# EasyEDA Pro project EZEDA_OpenLightingController.epro

# Schematic Main Schematic
Board Name: Board1; Create Date: 2026-04-04; Page Name: P1; Project Name: OpenLightingController; Schematic Name: Main Schematic; Update Date: 2026-04-09; Company: EasyEDA.com; Page Size: A4; Version: V1.0
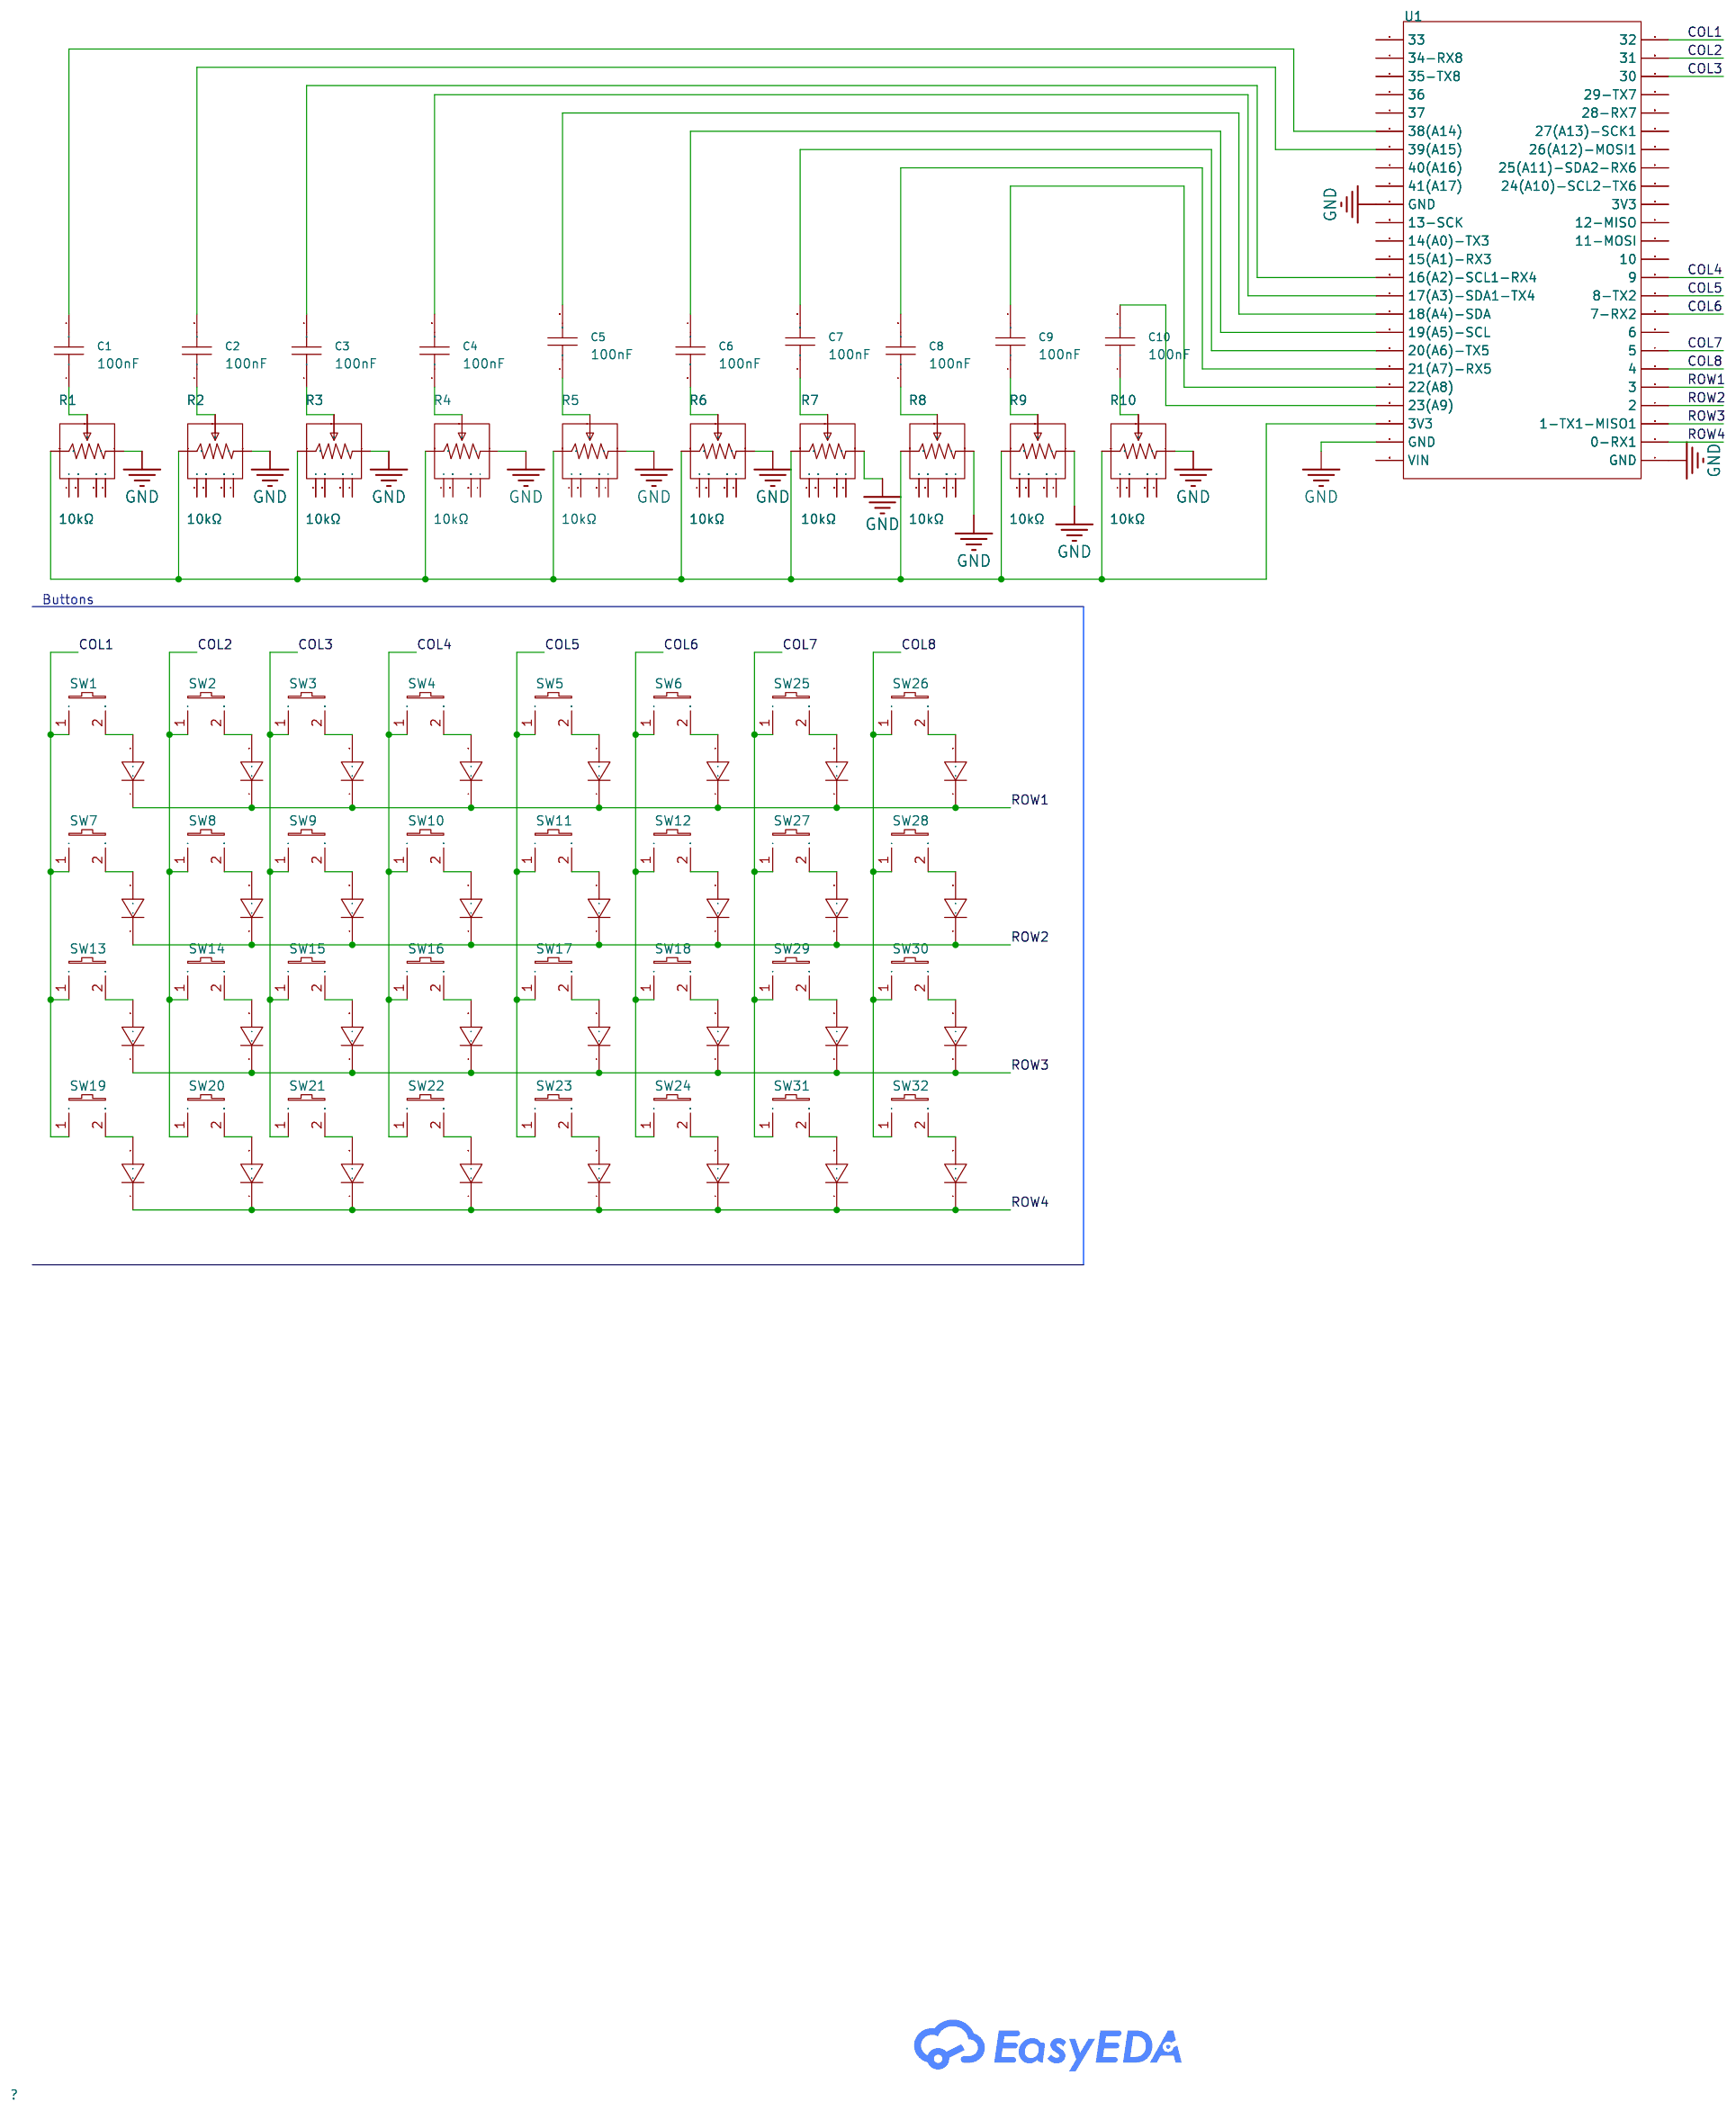
[diagram p0: schematic sheet]

## Parts
C1  100nF  [CAP-TH_L5.8-W2.4-P2.54-D0.6]
C2  100nF  [CAP-TH_L5.8-W2.4-P2.54-D0.6]
C3  100nF  [CAP-TH_L5.8-W2.4-P2.54-D0.6]
C4  100nF  [CAP-TH_L5.8-W2.4-P2.54-D0.6]
C5  100nF  [CAP-TH_L5.8-W2.4-P2.54-D0.6]
C6  100nF  [CAP-TH_L5.8-W2.4-P2.54-D0.6]
C7  100nF  [CAP-TH_L5.8-W2.4-P2.54-D0.6]
C8  100nF  [CAP-TH_L5.8-W2.4-P2.54-D0.6]
C9  100nF  [CAP-TH_L5.8-W2.4-P2.54-D0.6]
C10  100nF  [CAP-TH_L5.8-W2.4-P2.54-D0.6]
D1  1N4148  [DO-35_BD2.0-L4.0-P8.00-D0.5-FD]
D2  1N4148  [DO-35_BD2.0-L4.0-P8.00-D0.5-FD]
D3  1N4148  [DO-35_BD2.0-L4.0-P8.00-D0.5-FD]
D4  1N4148  [DO-35_BD2.0-L4.0-P8.00-D0.5-FD]
D5  1N4148  [DO-35_BD2.0-L4.0-P8.00-D0.5-FD]
D6  1N4148  [DO-35_BD2.0-L4.0-P8.00-D0.5-FD]
D7  1N4148  [DO-35_BD2.0-L4.0-P8.00-D0.5-FD]
D8  1N4148  [DO-35_BD2.0-L4.0-P8.00-D0.5-FD]
D9  1N4148  [DO-35_BD2.0-L4.0-P8.00-D0.5-FD]
D10  1N4148  [DO-35_BD2.0-L4.0-P8.00-D0.5-FD]
D11  1N4148  [DO-35_BD2.0-L4.0-P8.00-D0.5-FD]
D12  1N4148  [DO-35_BD2.0-L4.0-P8.00-D0.5-FD]
D13  1N4148  [DO-35_BD2.0-L4.0-P8.00-D0.5-FD]
D14  1N4148  [DO-35_BD2.0-L4.0-P8.00-D0.5-FD]
D15  1N4148  [DO-35_BD2.0-L4.0-P8.00-D0.5-FD]
D16  1N4148  [DO-35_BD2.0-L4.0-P8.00-D0.5-FD]
D17  1N4148  [DO-35_BD2.0-L4.0-P8.00-D0.5-FD]
D18  1N4148  [DO-35_BD2.0-L4.0-P8.00-D0.5-FD]
D19  1N4148  [DO-35_BD2.0-L4.0-P8.00-D0.5-FD]
D20  1N4148  [DO-35_BD2.0-L4.0-P8.00-D0.5-FD]
D21  1N4148  [DO-35_BD2.0-L4.0-P8.00-D0.5-FD]
D22  1N4148  [DO-35_BD2.0-L4.0-P8.00-D0.5-FD]
D23  1N4148  [DO-35_BD2.0-L4.0-P8.00-D0.5-FD]
D24  1N4148  [DO-35_BD2.0-L4.0-P8.00-D0.5-FD]
D25  1N4148  [DO-35_BD2.0-L4.0-P8.00-D0.5-FD]
D26  1N4148  [DO-35_BD2.0-L4.0-P8.00-D0.5-FD]
D27  1N4148  [DO-35_BD2.0-L4.0-P8.00-D0.5-FD]
D28  1N4148  [DO-35_BD2.0-L4.0-P8.00-D0.5-FD]
D29  1N4148  [DO-35_BD2.0-L4.0-P8.00-D0.5-FD]
D30  1N4148  [DO-35_BD2.0-L4.0-P8.00-D0.5-FD]
D31  1N4148  [DO-35_BD2.0-L4.0-P8.00-D0.5-FD]
D32  1N4148  [DO-35_BD2.0-L4.0-P8.00-D0.5-FD]
R1  10kΩ  [RES-ADJ-TH_PTA6043-2015DPB103]
R2  10kΩ  [RES-ADJ-TH_PTA6043-2015DPB103]
R3  10kΩ  [RES-ADJ-TH_PTA6043-2015DPB103]
R4  10kΩ  [RES-ADJ-TH_PTA6043-2015DPB103]
R5  10kΩ  [RES-ADJ-TH_PTA6043-2015DPB103]
R6  10kΩ  [RES-ADJ-TH_PTA6043-2015DPB103]
R7  10kΩ  [RES-ADJ-TH_PTA6043-2015DPB103]
R8  10kΩ  [RES-ADJ-TH_PTA6043-2015DPB103]
R9  10kΩ  [RES-ADJ-TH_PTA6043-2015DPB103]
R10  10kΩ  [RES-ADJ-TH_PTA6043-2015DPB103]
SW1  MX Switch  [SW-TH_MX1A-11NW]
SW2  MX Switch  [SW-TH_MX1A-11NW]
SW3  MX Switch  [SW-TH_MX1A-11NW]
SW4  MX Switch  [SW-TH_MX1A-11NW]
SW5  MX Switch  [SW-TH_MX1A-11NW]
SW6  MX Switch  [SW-TH_MX1A-11NW]
SW7  MX Switch  [SW-TH_MX1A-11NW]
SW8  MX Switch  [SW-TH_MX1A-11NW]
SW9  MX Switch  [SW-TH_MX1A-11NW]
SW10  MX Switch  [SW-TH_MX1A-11NW]
SW11  MX Switch  [SW-TH_MX1A-11NW]
SW12  MX Switch  [SW-TH_MX1A-11NW]
SW13  MX Switch  [SW-TH_MX1A-11NW]
SW14  MX Switch  [SW-TH_MX1A-11NW]
SW15  MX Switch  [SW-TH_MX1A-11NW]
SW16  MX Switch  [SW-TH_MX1A-11NW]
SW17  MX Switch  [SW-TH_MX1A-11NW]
SW18  MX Switch  [SW-TH_MX1A-11NW]
SW19  MX Switch  [SW-TH_MX1A-11NW]
SW20  MX Switch  [SW-TH_MX1A-11NW]
SW21  MX Switch  [SW-TH_MX1A-11NW]
SW22  MX Switch  [SW-TH_MX1A-11NW]
SW23  MX Switch  [SW-TH_MX1A-11NW]
SW24  MX Switch  [SW-TH_MX1A-11NW]
SW25  MX Switch  [SW-TH_MX1A-11NW]
SW26  MX Switch  [SW-TH_MX1A-11NW]
SW27  MX Switch  [SW-TH_MX1A-11NW]
SW28  MX Switch  [SW-TH_MX1A-11NW]
SW29  MX Switch  [SW-TH_MX1A-11NW]
SW30  MX Switch  [SW-TH_MX1A-11NW]
SW31  MX Switch  [SW-TH_MX1A-11NW]
SW32  MX Switch  [SW-TH_MX1A-11NW]
U1  -  [teensy 4.1]

## Library data of the parts
C1-C10 = CC1H104ZA1ED3F5P1100: Capacitance:100nF Tolerance:-20%~+80% Tolerance:-20%~+80% Voltage Rating:50V Pin Spacing:2.54mm Temperature Coefficient:Y5V Diameter:5.8mm Body Thickness:2.4mm; LCSC Part Name: 100nF -20%~+80% 50V; Supplier Part: C2832506; Manufacturer: Dersonic(德尔创); Supplier Footprint: 插件,P=2.54mm; JLCPCB Part Class: Extended Part; Datasheet: https://item.szlcsc.com/datasheet/CC1H104ZA1ED3F5P1100/2990644.html; Supplier: LCSC; Tolerance: -20%~+80%; Voltage Rating: 50V; Pin Spacing: 2.54mm; Temperature Coefficient: Y5V; Diameter: 5.8mm; Body Thickness: 2.4mm
D1-D32 = 1N4148_C258182: Diode Configuration:- Voltage - Forward(Vf@If):1V@10mA Voltage - DC Reverse(Vr):100V Current - Rectified:200mA Pd - Power Dissipation:500mW Reverse Leakage Current (Ir):5uA@75V Reverse Recovery Time (trr):4ns Operating Junction Temperature Range:-55℃~+175; LCSC Part Name: 100V 200mA; Supplier Part: C258182; Manufacturer: onsemi(安森美); Supplier Footprint: DO-35; JLCPCB Part Class: Extended Part; Datasheet: https://item.szlcsc.com/datasheet/1N4148/251208.html; Supplier: LCSC; Voltage - Forward(Vf@If): 1V@10mA; Voltage - DC Reverse(Vr): 100V; Current - Rectified: 200mA; Pd - Power Dissipation: 500mW; Reverse Leakage Current (Ir): 5uA@75V; Reverse Recovery Time (trr): 4ns; Operating Junction Temperature Range: -55℃~+175℃@(Tj); Non-Repetitive Peak Forward Surge Current: 4A
R1-R10 = PTA6043-2015CPB103: Resistance:10kΩ Tolerance:±20% Tolerance:±20% Voltage Rating:200V Power(Watts):250mW; LCSC Part Name: 10kΩ ±20%; Supplier Part: C17203852; Manufacturer: BOURNS; Supplier Footprint: 插件; JLCPCB Part Class: Extended Part; Datasheet: https://item.szlcsc.com/datasheet/PTA6043-2015CPB103/18332919.html; Supplier: LCSC; Tolerance: ±20%; Voltage Rating: 200V; Power(Watts): 250mW
SW1-SW32 = MX1A-11NW: Supplier Part: C3316924; Manufacturer: CHERRY; JLCPCB Part Class: Extended Part; Datasheet: https://item.szlcsc.com/datasheet/MX1A-11NW/3881518.html; Supplier: LCSC
U1 = teensy 4.1: _: 3

## Nets
GND: R1.1 R2.1 R3.1 R4.1 R5.1 R6.1 R7.1 R8.1 R9.1 R10.1 U1.1(GND) U1.26(GND) U1.39(GND)
COL1: SW1.1 SW7.1 SW13.1 SW19.1 U1.24(32)
COL2: SW2.1 SW8.1 SW14.1 SW20.1 U1.23(31)
COL3: SW3.1 SW9.1 SW15.1 SW21.1 U1.22(30)
COL4: SW4.1 SW10.1 SW16.1 SW22.1 U1.11(9)
COL5: SW5.1 SW11.1 SW17.1 SW23.1 U1.10(8-TX2)
COL6: SW6.1 SW12.1 SW18.1 SW24.1 U1.9(7-RX2)
COL7: SW25.1 SW27.1 SW29.1 SW31.1 U1.7(5)
COL8: SW26.1 SW28.1 SW30.1 SW32.1 U1.6(4)
ROW1: D1.1(K) D2.1(K) D3.1(K) D4.1(K) D5.1(K) D6.1(K) D25.1(K) D26.1(K) U1.5(3)
ROW2: D7.1(K) D8.1(K) D9.1(K) D10.1(K) D11.1(K) D12.1(K) D27.1(K) D28.1(K) U1.4(2)
ROW3: D13.1(K) D14.1(K) D15.1(K) D16.1(K) D17.1(K) D18.1(K) D29.1(K) D30.1(K) U1.3(1-TX1-MISO1)
ROW4: D19.1(K) D20.1(K) D21.1(K) D22.1(K) D23.1(K) D24.1(K) D31.1(K) D32.1(K) U1.2(0-RX1)
$1N3307: C1.1 R1.2
$1N3309: C2.1 R2.2
$1N3315: C3.1 R3.2
$1N3319: C4.1 R4.2
$1N3323: C5.1 R5.2
$1N3327: C6.2 R6.2
$1N3331: C7.1 R7.2
$1N3335: C8.1 R8.2
$1N3339: C9.1 R9.2
$1N3343: C10.1 R10.2
$1N3409: R1.3 R2.3 R3.3 R4.3 R5.3 R6.3 R7.3 R8.3 R9.3 R10.3 U1.27(3V3)
$1N3915: C1.2 U1.43(38(A14))
$1N3922: C2.2 U1.42(39(A15))
$1N3935: C3.2 U1.35(16(A2)-SCL1-RX4)
$1N3943: C4.2 U1.34(17(A3)-SDA1-TX4)
$1N3956: C5.2 U1.33(18(A4)-SDA)
$1N3968: C6.1 U1.32(19(A5)-SCL)
$1N3975: C7.2 U1.31(20(A6)-TX5)
$1N3984: C8.2 U1.30(21(A7)-RX5)
$1N3991: C9.2 U1.29(22(A8))
$1N4011: C10.2 U1.28(23(A9))
$1N7295: D1.2(A) SW1.2
$1N7660: D2.2(A) SW2.2
$1N7733: D3.2(A) SW3.2
$1N7806: D4.2(A) SW4.2
$1N7879: D5.2(A) SW5.2
$1N7952: D6.2(A) SW6.2
$1N8025: D7.2(A) SW7.2
$1N8098: D8.2(A) SW8.2
$1N8171: D9.2(A) SW9.2
$1N8244: D10.2(A) SW10.2
$1N8317: D11.2(A) SW11.2
$1N8390: D12.2(A) SW12.2
$1N9297: D13.2(A) SW13.2
$1N9301: D14.2(A) SW14.2
$1N9305: D15.2(A) SW15.2
$1N9309: D16.2(A) SW16.2
$1N9313: D17.2(A) SW17.2
$1N9317: D18.2(A) SW18.2
$1N9325: D20.2(A) SW20.2
$1N9329: D21.2(A) SW21.2
$1N9333: D22.2(A) SW22.2
$1N9337: D23.2(A) SW23.2
$1N9341: D24.2(A) SW24.2
$1N10421: D29.2(A) SW29.2
$1N10423: D30.2(A) SW30.2
$1N10425: D31.2(A) SW31.2
$1N10427: D32.2(A) SW32.2
$1N10429: D25.2(A) SW25.2
$1N10442: D27.2(A) SW27.2
$1N10444: D26.2(A) SW26.2
$1N10446: D28.2(A) SW28.2
$1N10514: D19.2(A) SW19.2

Not connected (* = marked no-connect by the designer): R1 4 5 6 7; R2 4 5 6 7; R3 4 5 6 7; R4 4 5 6 7; R5 4 5 6 7; R6 4 5 6 7; R7 4 5 6 7; R8 4 5 6 7; R9 4 5 6 7; R10 4 5 6 7; U1 8(6) 12(10) 13(11-MOSI) 14(12-MISO) 15(3V3) 16(24(A10)-SCL2-TX6) 17(25(A11)-SDA2-RX6) 18(26(A12)-MOSI1) 19(27(A13)-SCK1) 20(28-RX7) 21(29-TX7) 25(VIN) 36(15(A1)-RX3) 37(14(A0)-TX3) 38(13-SCK) 40(41(A17)) 41(40(A16)) 44(37) 45(36) 46(35-TX8) 47(34-RX8) 48(33)

## Notes on the sheet
- Buttons

# Board PCB1
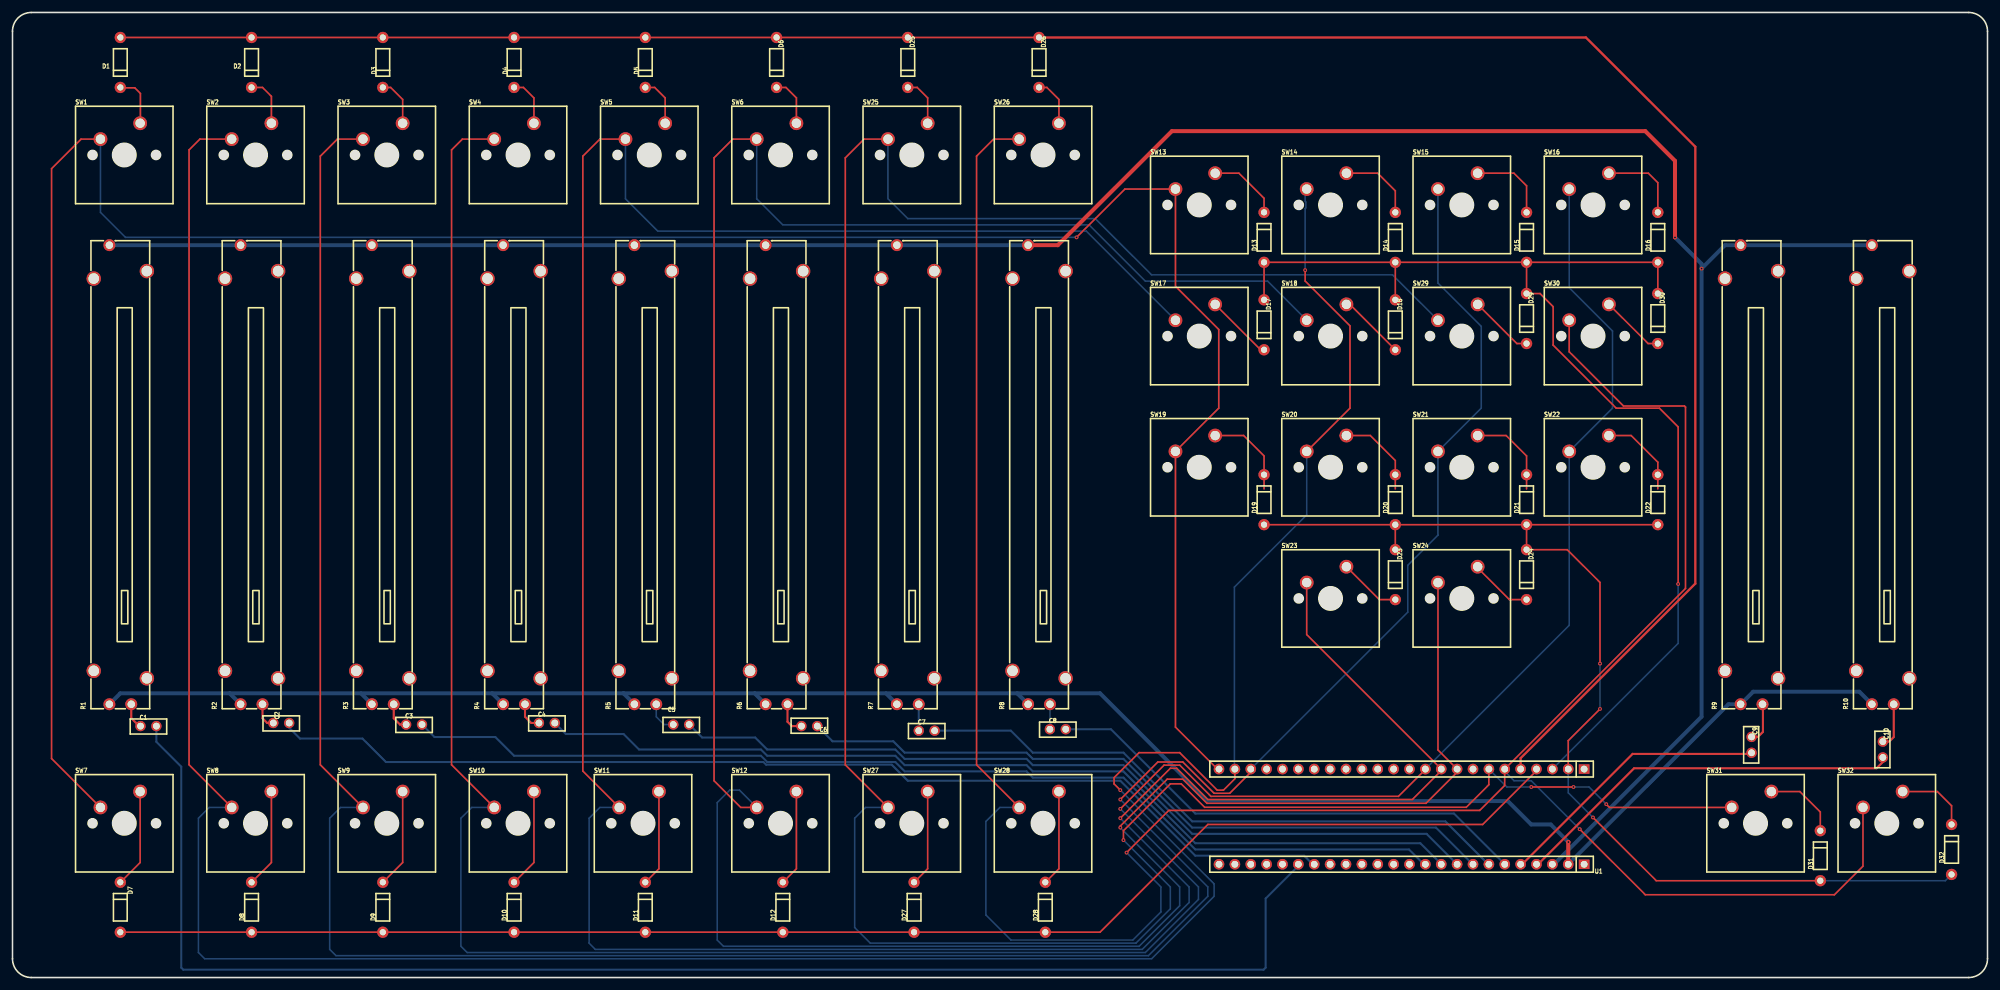
[diagram p1: board, top side]
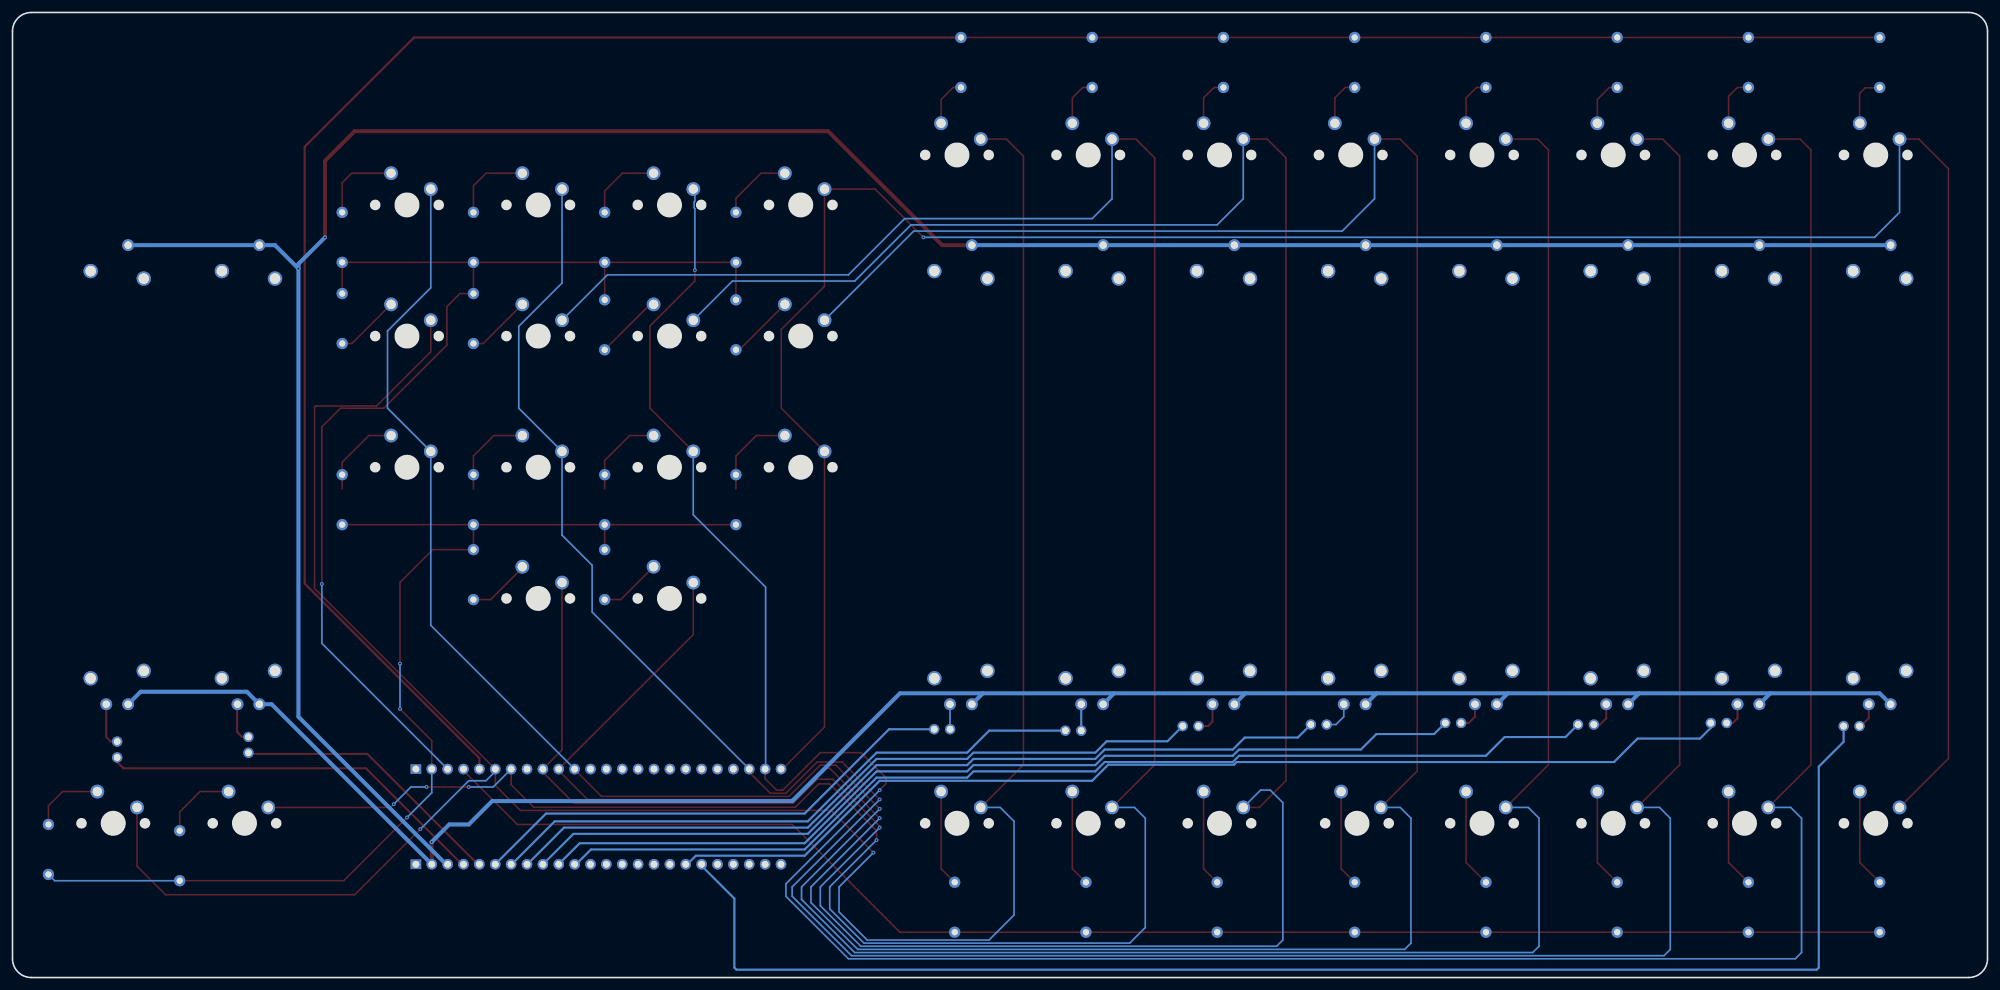
[diagram p2: board, bottom side, seen from below]

Outline 316 x 154.5 mm; copper layers: Top Layer, Bottom Layer. Coordinates in mm from the lower left corner of the outline.
Outline path: 0,151.5 0,3 arc(0.88,0.88) 3,0 313,0 arc(315.12,0.88) 316,3 316,151.5 arc(315.12,153.62) 313,154.5 3,154.5 arc(0.88,153.62) 0,151.5
Stack: Top Layer 0.035mm / Dielectric1 1.51mm FR4 er 4.5 / Bottom Layer 0.035mm

## Design rules (mm)
template: Custom Config
spacing copperThickness1oz (default): track to track 0.102, other pairs 0.152 to 0.3
spacing copperThickness2oz: track to track 0.203, other pairs 0.152 to 0.3
track width copperThickness1oz (default): min 0.127, default 0.254, max 2.54
track width copperThickness2oz: min 0.203, default 0.254, max 2.54
differential pair differentialPair (default): width min 0.127, default 0.254, max 2.54; gap min 0.152, default 0.152
via viaSize (default): diameter min 0.5, default 0.61, max 10; hole min 0.3, default 0.305, max 6.3

## Placement (name value [footprint] x y rotation side)
C1  100nF  [CAP-TH_L5.8-W2.4-P2.54-D0.6]  21.75 40.25 0 top
C2  100nF  [CAP-TH_L5.8-W2.4-P2.54-D0.6]  43 40.75 0 top
C3  100nF  [CAP-TH_L5.8-W2.4-P2.54-D0.6]  64.25 40.5 0 top
C4  100nF  [CAP-TH_L5.8-W2.4-P2.54-D0.6]  85.5 40.75 0 top
C5  100nF  [CAP-TH_L5.8-W2.4-P2.54-D0.6]  107 40.5 0 top
C6  100nF  [CAP-TH_L5.8-W2.4-P2.54-D0.6]  127.5 40.25 180 top
C7  100nF  [CAP-TH_L5.8-W2.4-P2.54-D0.6]  146.27 39.52 0 top
C8  100nF  [CAP-TH_L5.8-W2.4-P2.54-D0.6]  167.25 39.75 0 top
C9  100nF  [CAP-TH_L5.8-W2.4-P2.54-D0.6]  278.25 37.25 270 top
C10  100nF  [CAP-TH_L5.8-W2.4-P2.54-D0.6]  299.25 36.5 270 top
D1  1N4148  [DO-35_BD2.0-L4.0-P8.00-D0.5-FD]  17.25 146.5 270 top
D2  1N4148  [DO-35_BD2.0-L4.0-P8.00-D0.5-FD]  38.25 146.5 270 top
D3  1N4148  [DO-35_BD2.0-L4.0-P8.00-D0.5-FD]  59.25 146.5 270 top
D4  1N4148  [DO-35_BD2.0-L4.0-P8.00-D0.5-FD]  80.25 146.5 270 top
D5  1N4148  [DO-35_BD2.0-L4.0-P8.00-D0.5-FD]  101.25 146.5 270 top
D6  1N4148  [DO-35_BD2.0-L4.0-P8.00-D0.5-FD]  122.25 146.5 270 top
D7  1N4148  [DO-35_BD2.0-L4.0-P8.00-D0.5-FD]  17.25 11.25 90 top
D8  1N4148  [DO-35_BD2.0-L4.0-P8.00-D0.5-FD]  38.25 11.25 90 top
D9  1N4148  [DO-35_BD2.0-L4.0-P8.00-D0.5-FD]  59.25 11.25 90 top
D10  1N4148  [DO-35_BD2.0-L4.0-P8.00-D0.5-FD]  80.25 11.25 90 top
D11  1N4148  [DO-35_BD2.0-L4.0-P8.00-D0.5-FD]  101.25 11.25 90 top
D12  1N4148  [DO-35_BD2.0-L4.0-P8.00-D0.5-FD]  123.25 11.25 90 top
D13  1N4148  [DO-35_BD2.0-L4.0-P8.00-D0.5-FD]  200.25 118.5 90 top
D14  1N4148  [DO-35_BD2.0-L4.0-P8.00-D0.5-FD]  221.25 118.5 90 top
D15  1N4148  [DO-35_BD2.0-L4.0-P8.00-D0.5-FD]  242.25 118.5 90 top
D16  1N4148  [DO-35_BD2.0-L4.0-P8.00-D0.5-FD]  263.25 118.5 90 top
D17  1N4148  [DO-35_BD2.0-L4.0-P8.00-D0.5-FD]  200.25 104.5 270 top
D18  1N4148  [DO-35_BD2.0-L4.0-P8.00-D0.5-FD]  221.25 104.5 270 top
D19  1N4148  [DO-35_BD2.0-L4.0-P8.00-D0.5-FD]  200.25 76.5 90 top
D20  1N4148  [DO-35_BD2.0-L4.0-P8.00-D0.5-FD]  221.25 76.5 90 top
D21  1N4148  [DO-35_BD2.0-L4.0-P8.00-D0.5-FD]  242.25 76.5 90 top
D22  1N4148  [DO-35_BD2.0-L4.0-P8.00-D0.5-FD]  263.25 76.5 90 top
D23  1N4148  [DO-35_BD2.0-L4.0-P8.00-D0.5-FD]  221.25 64.5 270 top
D24  1N4148  [DO-35_BD2.0-L4.0-P8.00-D0.5-FD]  242.25 64.5 270 top
D25  1N4148  [DO-35_BD2.0-L4.0-P8.00-D0.5-FD]  143.25 146.5 270 top
D26  1N4148  [DO-35_BD2.0-L4.0-P8.00-D0.5-FD]  164.25 146.5 270 top
D27  1N4148  [DO-35_BD2.0-L4.0-P8.00-D0.5-FD]  144.25 11.25 90 top
D28  1N4148  [DO-35_BD2.0-L4.0-P8.00-D0.5-FD]  165.25 11.25 90 top
D29  1N4148  [DO-35_BD2.0-L4.0-P8.00-D0.5-FD]  242.25 105.5 270 top
D30  1N4148  [DO-35_BD2.0-L4.0-P8.00-D0.5-FD]  263.25 105.5 270 top
D31  1N4148  [DO-35_BD2.0-L4.0-P8.00-D0.5-FD]  289.25 19.5 90 top
D32  1N4148  [DO-35_BD2.0-L4.0-P8.00-D0.5-FD]  310.25 20.5 90 top
R1  10kΩ  [RES-ADJ-TH_PTA6043-2015DPB103]  17.25 80.5 90 top
R2  10kΩ  [RES-ADJ-TH_PTA6043-2015DPB103]  38.25 80.5 90 top
R3  10kΩ  [RES-ADJ-TH_PTA6043-2015DPB103]  59.25 80.5 90 top
R4  10kΩ  [RES-ADJ-TH_PTA6043-2015DPB103]  80.25 80.5 90 top
R5  10kΩ  [RES-ADJ-TH_PTA6043-2015DPB103]  101.25 80.5 90 top
R6  10kΩ  [RES-ADJ-TH_PTA6043-2015DPB103]  122.25 80.5 90 top
R7  10kΩ  [RES-ADJ-TH_PTA6043-2015DPB103]  143.25 80.5 90 top
R8  10kΩ  [RES-ADJ-TH_PTA6043-2015DPB103]  164.25 80.5 90 top
R9  10kΩ  [RES-ADJ-TH_PTA6043-2015DPB103]  278.25 80.5 90 top
R10  10kΩ  [RES-ADJ-TH_PTA6043-2015DPB103]  299.25 80.5 90 top
SW1  MX Switch  [SW-TH_MX1A-11NW]  17.25 135.5 0 top
SW2  MX Switch  [SW-TH_MX1A-11NW]  38.25 135.5 0 top
SW3  MX Switch  [SW-TH_MX1A-11NW]  59.25 135.5 0 top
SW4  MX Switch  [SW-TH_MX1A-11NW]  80.25 135.5 0 top
SW5  MX Switch  [SW-TH_MX1A-11NW]  101.25 135.5 0 top
SW6  MX Switch  [SW-TH_MX1A-11NW]  122.25 135.5 0 top
SW7  MX Switch  [SW-TH_MX1A-11NW]  17.25 28.5 0 top
SW8  MX Switch  [SW-TH_MX1A-11NW]  38.25 28.5 0 top
SW9  MX Switch  [SW-TH_MX1A-11NW]  59.25 28.5 0 top
SW10  MX Switch  [SW-TH_MX1A-11NW]  80.25 28.5 0 top
SW11  MX Switch  [SW-TH_MX1A-11NW]  100.25 28.5 0 top
SW12  MX Switch  [SW-TH_MX1A-11NW]  122.25 28.5 0 top
SW13  MX Switch  [SW-TH_MX1A-11NW]  189.25 127.5 0 top
SW14  MX Switch  [SW-TH_MX1A-11NW]  210.25 127.5 0 top
SW15  MX Switch  [SW-TH_MX1A-11NW]  231.25 127.5 0 top
SW16  MX Switch  [SW-TH_MX1A-11NW]  252.25 127.5 0 top
SW17  MX Switch  [SW-TH_MX1A-11NW]  189.25 106.5 0 top
SW18  MX Switch  [SW-TH_MX1A-11NW]  210.25 106.5 0 top
SW19  MX Switch  [SW-TH_MX1A-11NW]  189.25 85.5 0 top
SW20  MX Switch  [SW-TH_MX1A-11NW]  210.25 85.5 0 top
SW21  MX Switch  [SW-TH_MX1A-11NW]  231.25 85.5 0 top
SW22  MX Switch  [SW-TH_MX1A-11NW]  252.25 85.5 0 top
SW23  MX Switch  [SW-TH_MX1A-11NW]  210.25 64.5 0 top
SW24  MX Switch  [SW-TH_MX1A-11NW]  231.25 64.5 0 top
SW25  MX Switch  [SW-TH_MX1A-11NW]  143.25 135.5 0 top
SW26  MX Switch  [SW-TH_MX1A-11NW]  164.25 135.5 0 top
SW27  MX Switch  [SW-TH_MX1A-11NW]  143.25 28.5 0 top
SW28  MX Switch  [SW-TH_MX1A-11NW]  164.25 28.5 0 top
SW29  MX Switch  [SW-TH_MX1A-11NW]  231.25 106.5 0 top
SW30  MX Switch  [SW-TH_MX1A-11NW]  252.25 106.5 0 top
SW31  MX Switch  [SW-TH_MX1A-11NW]  278.25 28.5 0 top
SW32  MX Switch  [SW-TH_MX1A-11NW]  299.25 28.5 0 top
U1  -  [teensy 4.1]  222.25 25.75 180 top

## Footprints (pads in the part's own frame, mm; a bottom-side part is the same pattern mirrored in y, then rotated)
CAP-TH_L5.8-W2.4-P2.54-D0.6
  round 1.65 hole 1.1: 1(-1.27,0) 2(1.27,0)
DO-35_BD2.0-L4.0-P8.00-D0.5-FD
  round 1.8 hole 1: 1(-4,0) 2(4,0)
RES-ADJ-TH_PTA6043-2015DPB103
  round 1.9 hole 1.2: 1(-36.75,1.75) 2(-36.75,-1.75) 3(36.75,1.75)
  round 2.3 hole 1.7: 4(-31.4,4.25) 5(31.4,4.25) 6(-32.6,-4.25) 7(32.6,-4.25)
SW-TH_MX1A-11NW
  round 2.2 hole 1.5: 1(-3.175,-1.27) 2(3.175,1.27)
teensy 4.1
  rect 1.7x1.524 hole 1.1: 1(-29.21,-7.62) 25(-29.21,7.62)
  round 1.7 hole 1.1: 2(-26.67,-7.62) 3(-24.13,-7.62) 4(-21.59,-7.62) 5(-19.05,-7.62) 6(-16.51,-7.62) 7(-13.97,-7.62) 8(-11.43,-7.62) 9(-8.89,-7.62) 10(-6.35,-7.62) 11(-3.81,-7.62) 12(-1.27,-7.62) 13(1.27,-7.62) 14(3.81,-7.62) 15(6.35,-7.62) 16(8.89,-7.62) 17(11.43,-7.62) 18(13.97,-7.62) 19(16.51,-7.62) 20(19.05,-7.62) 21(21.59,-7.62) 22(24.13,-7.62) 23(26.67,-7.62) 24(29.21,-7.62) 26(-26.67,7.62) 27(-24.13,7.62) 28(-21.59,7.62) 29(-19.05,7.62) 30(-16.51,7.62) 31(-13.97,7.62) 32(-11.43,7.62) 33(-8.89,7.62) 34(-6.35,7.62) 35(-3.81,7.62) 36(-1.27,7.62) 37(1.27,7.62) 38(3.81,7.62) 39(6.35,7.62) 40(8.89,7.62) 41(11.43,7.62) 42(13.97,7.62) 43(16.51,7.62) 44(19.05,7.62) 45(21.59,7.62) 46(24.13,7.62) 47(26.67,7.62) 48(29.21,7.62)

## Nets
As in the schematic, except:
GND: R1.1 R2.1 R3.1 R4.1 R5.1 R6.1 R7.1 R8.1 R9.1 R10.1 U1.26

Pads without a net: R1 4 5 6 7; R2 4 5 6 7; R3 4 5 6 7; R4 4 5 6 7; R5 4 5 6 7; R6 4 5 6 7; R7 4 5 6 7; R8 4 5 6 7; R9 4 5 6 7; R10 4 5 6 7; U1 1 8 12 13 14 15 16 17 18 19 20 21 25 36 37 38 39 40 41 44 45 46 47 48

## Via types
v1: diameter 0.61, hole 0.305, Top Layer to Bottom Layer, 19 vias
v2: diameter 0.66, hole 0.305, Top Layer to Bottom Layer, 1 via

## Routing (per net, layer and track width the routed paths; a pad name or vN(x,y) marks a point on that pad's centre or on a via; arc(x,y) is an arc through that point)
GND: length 325.8
  Top Layer w0.635: v2(248.94,21.69) 248.92,21.67 U1.26
  Bottom Layer w0.635: 97.75,45.5 118.75,45.5 ; 97.75,45.5 76.75,45.5 ; 97.75,45.5 R5.1 ; 118.75,45.5 139.75,45.5 ; 118.75,45.5 R6.1 ; 139.75,45.5 160.75,45.5 ; 139.75,45.5 R7.1 ; 76.75,45.5 55.75,45.5 ; 76.75,45.5 R4.1 ; v2(248.94,21.69) 246.12,24.5 243,24.5 239.25,28.25 191.25,28.25 174,45.5 160.75,45.5 ; 55.75,45.5 34.75,45.5 ; 55.75,45.5 R3.1 ; 34.75,45.5 R2.1 ; 34.75,45.5 17.25,45.5 R1.1 ; 160.75,45.5 R8.1 ; R10.1 295.5,45.75 278.5,45.75 R9.1 274.54,43.75 U1.26
COL1: length 405.6
  Top Layer w0.254: 193.04,33.12 186.07,40.09 SW19.1 193,91.16 193,103.75 186.07,110.67 SW13.1 177.98,126.23 v1(170.25,118.5) ; SW1.1 10.98,134.23 6.25,129.5 6.25,35.06 SW7.1
  Bottom Layer w0.254: v1(170.25,118.5) 18.07,118.5 14.07,122.5 SW1.1
COL2: length 465.1
  Top Layer w0.254: v1(177.25,30) 176.25,31 176.25,32 180.25,36 186.75,36 192.75,30 193.75,30 195.58,31.83 195.58,33.12 ; SW8.1 28.25,34.06 28.25,132.5 29.98,134.23 SW2.1 ; v1(206.82,113.25) 206.82,111.5 214,104.33 214,91.16 SW20.1
  Bottom Layer w0.254: v1(206.82,113.25) 206.82,123.11 206.94,123.22 206.94,124.16 206.82,124.27 206.82,125.98 SW14.1 ; v1(177.25,30) 192.25,15 192.25,13 182.25,3 30.75,3 29.75,4 29.75,25.5 31.48,27.23 SW8.1 ; SW20.1 207.07,74.08 195.5,62.5 195.5,33.45 U1.23
COL3: length 446.3
  Top Layer w0.254: SW3.1 51.98,134.23 49.25,131.5 49.25,34.06 SW9.1 ; v1(177.25,28.5) 183.25,34.5 187.25,34.5 192.25,29.5 194.75,29.5 198.12,32.87 198.12,33.12
  Bottom Layer w0.254: v1(177.25,28.5) 191.25,14.5 191.25,13 181.75,3.5 51.75,3.5 50.75,4.5 50.75,25.5 52.48,27.23 SW9.1 ; SW15.1 228.07,111.17 235,104.25 235,91.16 SW21.1 228.07,70.83 223.25,66 223.25,58.5 U1.22
COL4: length 447.4
  Top Layer w0.254: SW10.1 70.25,34.06 70.25,132.5 71.98,134.23 SW4.1 ; 226.06,33.12 225.87,33.12 221.75,29 191.75,29 186.75,34 184.25,34 v1(177.25,27)
  Bottom Layer w0.254: SW16.1 249.07,110.42 256,103.5 256,91.16 SW22.1 249.07,56.38 U1.11 ; SW10.1 73.48,27.23 71.75,25.5 71.75,5 72.75,4 181.25,4 189.75,12.5 189.75,14.5 v1(177.25,27)
COL5: length 460.8
  Top Layer w0.254: SW11.1 91.25,33.06 91.25,131.5 93.98,134.23 SW5.1 ; v1(177.25,25.5) 185.25,33.5 186.25,33.5 191.25,28.5 223.98,28.5 228.6,33.12 ; SW23.1 207.07,54.9 U1.10
  Bottom Layer w0.254: v1(177.25,25.5) 188.25,14.5 188.25,12 180.75,4.5 93.25,4.5 92.25,5.5 92.25,25.5 93.98,27.23 SW11.1 ; SW17.1 171.81,119.5 103.25,119.5 98.08,124.67 SW5.1
COL6: length 438.1
  Top Layer w0.254: SW24.1 228.07,36.44 U1.9 ; v1(177.25,24) 177.25,24.25 184.75,31.75 187.25,31.75 191.1,27.89 226.16,27.89 231.14,32.87 231.14,33.12 ; SW6.1 115.25,134.23 112.25,131.23 112.25,31.5 116.52,27.23 SW12.1
  Bottom Layer w0.254: SW12.1 116.31,30 114.75,30 112.75,28 112.75,6 113.75,5 180.25,5 186.75,11.5 186.75,14.5 v1(177.25,24) ; SW18.1 200.81,111.5 181.25,111.5 172.25,120.5 123.25,120.5 119.08,124.67 SW6.1
COL7: length 422
  Top Layer w0.254: SW27.1 133.25,34.06 133.25,131.23 136.25,134.23 SW25.1 ; v1(177.75,22) 177.75,23.5 185.25,31 187,31 190.75,27.25 232.6,27.25 236.22,30.87 U1.7 ; v1(255,27.75) 255.52,27.23 SW31.1 ; v1(249.75,30.5) v1(243,30.5)
  Bottom Layer w0.254: SW25.1 140.07,124.67 143.25,121.5 173.25,121.5 182.25,112.5 220.81,112.5 SW29.1 ; v1(177.75,22) 185.25,14.5 185.25,11 179.75,5.5 137.25,5.5 134.75,8 134.75,25.5 136.48,27.23 SW27.1 ; v1(255,27.75) 252.25,30.5 v1(249.75,30.5) ; U1.7 239.09,30.5 v1(243,30.5)
COL8: length 421.6
  Top Layer w0.254: v1(178.25,20) 185,26.75 234.75,26.75 238.75,30.75 238.75,33.36 U1.6 267.68,62.29 267.68,91.32 267.5,91.5 257.75,91.5 249.07,100.17 SW30.1 ; v1(250.75,23.75) 261.25,13.25 291.5,13.25 296.07,17.82 SW32.1 ; SW28.1 154.25,34.06 154.25,131.5 156.98,134.23 SW26.1
  Bottom Layer w0.254: v1(178.25,20) 183.75,14.5 183.75,10.5 179.25,6 159.75,6 155.75,10 155.75,25 157.98,27.23 SW28.1 ; U1.6 238.76,32.99 240.25,31.5 243,31.5 v1(250.75,23.75)
ROW1: length 370.4
  Top Layer w0.254: 17.34,150.5 D2.1 D3.1 D4.1 D5.1 D6.1 D25.1 D26.1
  Top Layer w0.355: D26.1 251.75,150.5 269.25,133 269.25,63.07 241.3,35.12 U1.5
ROW2: length 237.3
  Top Layer w0.254: D7.1 D8.1 D9.1 D10.1 D11.1 D12.1 D27.1 D28.1 174,7.25 191.25,24.5 235.22,24.5 243.84,33.12
ROW3: length 184.8
  Top Layer w0.254: D15.1 D16.1 D30.1 ; D15.1 D14.1 ; D15.1 D29.1 244.41,109.5 246.5,107.41 246.5,101.25 256.61,91.14 263.51,91.14 266.5,88.16 v1(266.5,63) ; D14.1 D13.1 D17.1 ; D14.1 D18.1
  Bottom Layer w0.254: U1.3 266.5,53.49 v1(266.5,63)
ROW4: length 188.3
  Top Layer w0.254: v1(254,43) 248.92,37.92 U1.2 ; D23.1 D20.1 ; D20.1 D21.1 ; D20.1 D19.1 ; D21.1 D24.1 248.75,68.5 254,63.25 v1(254,50.25) ; D21.1 D22.1 ; v1(252.88,25.62) 263,15.5 D31.1
  Bottom Layer w0.254: v1(252.88,25.62) 248.92,29.58 U1.2 ; D31.1 309.25,15.5 D32.1 ; v1(254,50.25) v1(254,43)
$1N3307: length 4.2
  Top Layer w0.33: R1.2 19,41.52 20.27,40.25 C1.1
$1N3309: length 4.3
  Top Layer w0.33: R2.2 40,41.5 40.75,40.75 C2.1
$1N3315: length 4.6
  Top Layer w0.33: C3.1 62,40.5 61,41.5 R3.2
$1N3319: length 4.6
  Top Layer w0.33: C4.1 83,40.75 82,41.75 R4.2
$1N3323: length 5.2
  Bottom Layer w0.254: C5.1 104.25,40.5 103,41.75 R5.2
$1N3327: length 5.3
  Top Layer w0.33: R6.2 124,40.95 124.7,40.25 C6.2
$1N3331: length 4.2
  Bottom Layer w0.33: R7.2 C7.1
$1N3335: length 4.1
  Bottom Layer w0.254: R8.2 166,39.98 166.23,39.75
$1N3339: length 6.6
  Top Layer w0.33: C9.1 279.27,38.52 280.06,39.31 280.06,43.69 R9.2
$1N3343: length 7.3
  Top Layer w0.33: C10.1 300.27,37.77 301,38.5 R10.2
$1N3409: length 413.3
  Top Layer w0.635: v1(266,118.5) 266,130.75 261.25,135.5 185.5,135.5 167.25,117.25 R8.3
  Bottom Layer w0.635: v1(270.25,113.5) 274,117.25 R9.3 R10.3 ; v1(270.25,113.5) 270.25,41.75 246.38,17.88 ; v1(270.25,113.5) 270.25,114.25 v1(266,118.5) ; R8.3 R7.3 R6.3 R5.3 R4.3 R3.3 R2.3 R1.3
$1N3915: length 232.6
  Bottom Layer w0.33: C1.2 23.02,37.73 27,33.75 27,1.58 27.33,1.25 200.17,1.25 200.5,1.58 200.5,12.64 205.74,17.88
$1N3922: length 173.9
  Bottom Layer w0.33: 208.28,17.88 206.66,19.5 189.25,19.5 177.25,31.5 143.25,31.5 140.68,34.07 120.57,34.07 120.14,34.5 59.75,34.5 56,38.25 46,38.25 44.27,39.98 C2.2
$1N3935: length 169.9
  Bottom Layer w0.33: C3.2 67.52,38.5 77.25,38.5 80.25,35.5 119.75,35.5 120.75,34.5 141.25,34.5 142.75,33 162.25,33 163.25,32 177.75,32 189.25,20.5 223.44,20.5 226.06,17.88
$1N3943: length 151.5
  Bottom Layer w0.33: 228.6,17.88 228.6,18.15 225.25,21.5 189.25,21.5 177.75,33 163.25,33 162.25,34 142.75,34 141.25,35.5 120.75,35.5 119.75,36.5 100.25,36.5 97.77,38.98 88.54,38.98 C4.2
$1N3956: length 132.4
  Bottom Layer w0.33: C5.2 110.35,38.42 118.83,38.42 120.75,36.5 141.25,36.5 142.75,35 162.25,35 163.25,34 177.75,34 188.75,23 226.25,23 231.14,18.11 231.14,17.88
$1N3968: length 114.3
  Bottom Layer w0.33: 233.68,17.88 233.68,18.07 227.75,24 188.75,24 177.75,35 163.25,35 162.25,36 142.75,36 140.93,37.82 131.2,37.82 C6.1
$1N3975: length 97.7
  Bottom Layer w0.33: C7.2 159.73,39.52 163.25,36 177.75,36 188.75,25 229.25,25 236.22,18.03 236.22,17.88
$1N3984: length 79.4
  Bottom Layer w0.33: C8.2 175.75,39.75 189.25,26.25 230.64,26.25 U1.30 238.76,17.88
$1N3991: length 44.4
  Top Layer w0.33: C9.2 278.07,35.8 259.22,35.8 241.3,17.88
$1N4011: length 63
  Top Layer w0.33: C10.2 299.25,34.5 298.25,33.5 259.46,33.5 243.84,17.88
$1N7295: length 8.4
  Top Layer w0.254: SW1.2 20.46,136.81 20.46,141.53 19.55,142.44 17.31,142.44 D1.2
$1N7660: length 8.1
  Top Layer w0.254: D2.2 40,142.5 41.42,141.07 SW2.2
$1N7733: length 7.8
  Top Layer w0.254: SW3.2 62.42,140.57 60.5,142.5 D3.2
$1N7806: length 7.9
  Top Layer w0.254: SW4.2 83.42,140.82 81.75,142.5 D4.2
$1N7879: length 7.9
  Top Layer w0.254: SW5.2 104.42,140.82 102.75,142.5 D5.2
$1N7952: length 7.9
  Top Layer w0.254: D6.2 123.75,142.5 125.42,140.82 SW6.2
$1N8025: length 15.9
  Top Layer w0.254: 17.25,15.24 20.43,18.41 SW7.2
$1N8098: length 15.9
  Top Layer w0.254: 38.25,15.24 41.42,18.41 SW8.2
$1N8171: length 15.9
  Top Layer w0.254: 59.25,15.24 62.42,18.41 SW9.2
$1N8244: length 15.9
  Top Layer w0.254: SW10.2 83.42,18.41 80.25,15.24
$1N8317: length 15.4
  Top Layer w0.254: SW11.2 103.42,17.41 101.25,15.24
$1N8390: length 15.4
  Top Layer w0.254: SW12.2 125.42,17.41 123.25,15.24
$1N9297: length 11.7
  Top Layer w0.254: D13.2 200.25,124.75 196.23,128.77 SW13.2
$1N9301: length 12.4
  Top Layer w0.254: SW14.2 218.42,128.77 221.25,125.94 D14.2
$1N9305: length 12.9
  Top Layer w0.254: SW15.2 240.23,128.77 242.25,126.75 D15.2
$1N9309: length 13.3
  Top Layer w0.254: 263.25,122.44 263.25,127.25 261.73,128.77 SW16.2
$1N9313: length 10.8
  Top Layer w0.254: SW17.2 199.69,100.5 D17.2
$1N9317: length 10.8
  Top Layer w0.254: D18.2 213.98,107.77 SW18.2
$1N9325: length 15
  Top Layer w0.254: 212.43,86.77 217.25,86.77 221.25,82.77 D20.2 221.25,78.23
$1N9329: length 14.4
  Top Layer w0.254: 242.25,78.23 D21.2 242.25,83.5 238.98,86.77 SW21.2
$1N9333: length 13.9
  Top Layer w0.254: SW22.2 258.98,86.77 263.25,82.5 D22.2 263.25,78.23
$1N9337: length 10
  Top Layer w0.254: SW23.2 218.69,60.5 D23.2
$1N9341: length 10.1
  Top Layer w0.254: D24.2 239.5,60.5 234.43,65.58 SW24.2
$1N10421: length 10.4
  Top Layer w0.254: D29.2 240.69,101.5 SW29.2
$1N10423: length 10.4
  Top Layer w0.254: SW30.2 261.69,101.5 D30.2
$1N10425: length 12.2
  Top Layer w0.254: D31.2 289.25,26.5 285.98,29.77 SW31.2
$1N10427: length 11.8
  Top Layer w0.254: SW32.2 307.98,29.77 310.25,27.5 D32.2
$1N10429: length 7.9
  Top Layer w0.254: SW25.2 146.43,140.82 144.75,142.5 D25.2
$1N10442: length 15.4
  Top Layer w0.254: 144.25,15.24 146.43,17.41 SW27.2
$1N10444: length 7.8
  Top Layer w0.254: SW26.2 167.43,140.57 165.5,142.5 D26.2
$1N10446: length 15.4
  Top Layer w0.254: 165.25,15.24 167.43,17.41 SW28.2
$1N10514: length 14.4
  Top Layer w0.254: SW19.2 196.98,86.77 200.25,83.5 D19.2 200.25,78.23
